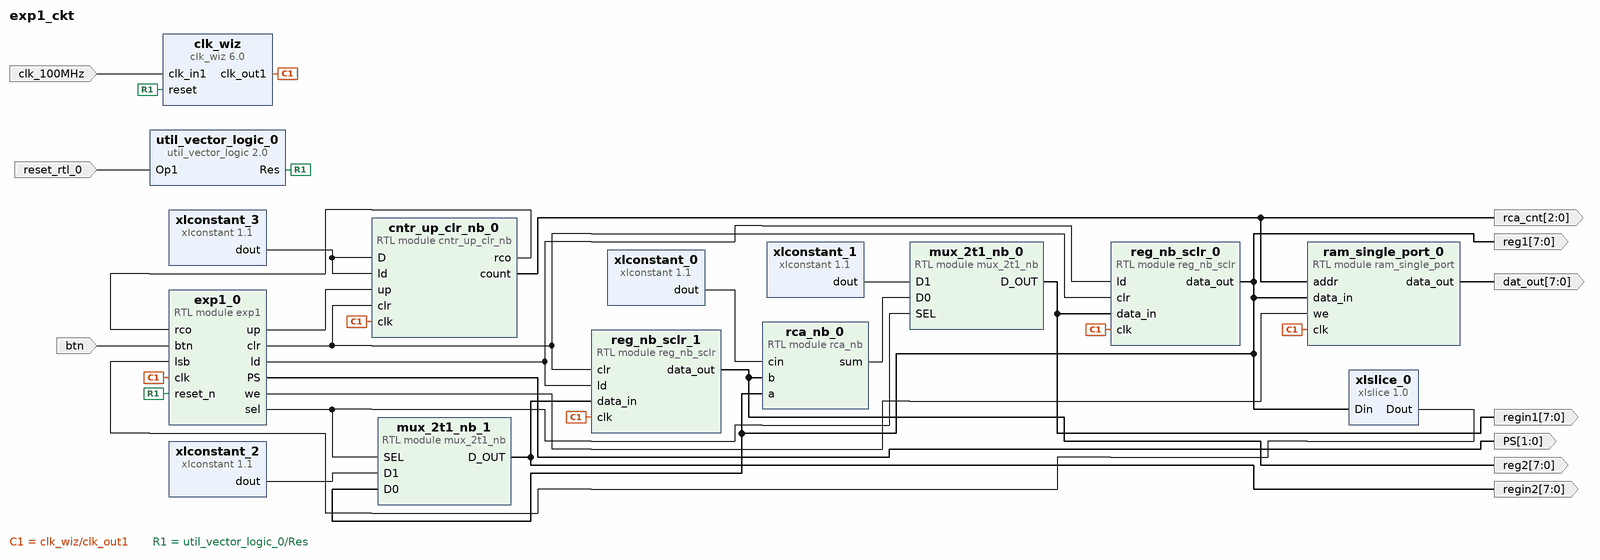
[diagram p0: block diagram of the top level]
# Vivado block design exp1_ckt, xc7a35tcpg236-1, Vivado 2021.2
create_bd_design exp1_ckt

create_bd_port -dir I -type clk clk_100MHz
set_property -dict {CONFIG.FREQ_HZ 100000000} [get_bd_ports clk_100MHz]
create_bd_port -dir I -type rst reset_rtl_0
set_property -dict {CONFIG.POLARITY ACTIVE_LOW} [get_bd_ports reset_rtl_0]
create_bd_port -dir I btn
create_bd_port -dir O -from 7 -to 0 dat_out
create_bd_port -dir O -from 7 -to 0 reg1
create_bd_port -dir O -from 7 -to 0 reg2
create_bd_port -dir O -from 7 -to 0 regin1
create_bd_port -dir O -from 7 -to 0 regin2
create_bd_port -dir O -from 2 -to 0 rca_cnt
create_bd_port -dir O -from 1 -to 0 PS

create_bd_cell -type module -reference ram_single_port ram_single_port_0
set_property -dict {CONFIG.m 8 CONFIG.n 3} [get_bd_cells ram_single_port_0]
create_bd_cell -type module -reference reg_nb_sclr reg_nb_sclr_0
create_bd_cell -type module -reference reg_nb_sclr reg_nb_sclr_1
create_bd_cell -type ip -vlnv xilinx.com:ip:xlconstant:1.1 xlconstant_0
set_property -dict {CONFIG.CONST_VAL 0} [get_bd_cells xlconstant_0]
create_bd_cell -type ip -vlnv xilinx.com:ip:xlslice:1.0 xlslice_0
set_property -dict {CONFIG.DIN_WIDTH 8} [get_bd_cells xlslice_0]
create_bd_cell -type module -reference mux_2t1_nb mux_2t1_nb_0
create_bd_cell -type ip -vlnv xilinx.com:ip:clk_wiz:6.0 clk_wiz
create_bd_cell -type module -reference mux_2t1_nb mux_2t1_nb_1
create_bd_cell -type ip -vlnv xilinx.com:ip:xlconstant:1.1 xlconstant_1
set_property -dict {CONFIG.CONST_VAL 1 CONFIG.CONST_WIDTH 8} [get_bd_cells xlconstant_1]
create_bd_cell -type ip -vlnv xilinx.com:ip:xlconstant:1.1 xlconstant_2
set_property -dict {CONFIG.CONST_VAL 0 CONFIG.CONST_WIDTH 8} [get_bd_cells xlconstant_2]
create_bd_cell -type ip -vlnv xilinx.com:ip:util_vector_logic:2.0 util_vector_logic_0
set_property -dict {CONFIG.C_OPERATION not} [get_bd_cells util_vector_logic_0]
create_bd_cell -type module -reference rca_nb rca_nb_0
create_bd_cell -type ip -vlnv xilinx.com:ip:xlconstant:1.1 xlconstant_3
set_property -dict {CONFIG.CONST_VAL 0 CONFIG.CONST_WIDTH 3} [get_bd_cells xlconstant_3]
create_bd_cell -type module -reference cntr_up_clr_nb cntr_up_clr_nb_0
set_property -dict {CONFIG.n 3} [get_bd_cells cntr_up_clr_nb_0]
create_bd_cell -type module -reference exp1 exp1_0

# ---- connections ----

connect_bd_net [get_bd_pins clk_wiz/clk_out1] \
  [get_bd_pins ram_single_port_0/clk] [get_bd_pins reg_nb_sclr_0/clk] [get_bd_pins reg_nb_sclr_1/clk] \
  [get_bd_pins cntr_up_clr_nb_0/clk] [get_bd_pins exp1_0/clk]
connect_bd_net [get_bd_pins exp1_0/ld] [get_bd_pins reg_nb_sclr_1/ld] [get_bd_pins reg_nb_sclr_0/ld]
connect_bd_net [get_bd_pins exp1_0/clr] [get_bd_pins reg_nb_sclr_1/clr] [get_bd_pins reg_nb_sclr_0/clr] [get_bd_pins cntr_up_clr_nb_0/clr]
connect_bd_net [get_bd_ports btn] [get_bd_pins exp1_0/btn]
connect_bd_net [get_bd_ports clk_100MHz] [get_bd_pins clk_wiz/clk_in1]
connect_bd_net -net cntr_udclr_nb_0_count [get_bd_pins cntr_up_clr_nb_0/count] [get_bd_pins ram_single_port_0/addr] [get_bd_ports rca_cnt]
connect_bd_net [get_bd_pins cntr_up_clr_nb_0/rco] [get_bd_pins exp1_0/rco]
connect_bd_net [get_bd_pins exp1_0/PS] [get_bd_ports PS]
connect_bd_net [get_bd_pins exp1_0/sel] [get_bd_pins mux_2t1_nb_0/SEL] [get_bd_pins mux_2t1_nb_1/SEL]
connect_bd_net [get_bd_pins exp1_0/up] [get_bd_pins cntr_up_clr_nb_0/up]
connect_bd_net [get_bd_pins exp1_0/we] [get_bd_pins ram_single_port_0/we]
connect_bd_net [get_bd_pins mux_2t1_nb_0/D_OUT] [get_bd_pins reg_nb_sclr_0/data_in] [get_bd_ports regin1]
connect_bd_net [get_bd_pins mux_2t1_nb_1/D_OUT] [get_bd_pins reg_nb_sclr_1/data_in] [get_bd_ports regin2]
connect_bd_net [get_bd_pins ram_single_port_0/data_out] [get_bd_ports dat_out]
connect_bd_net [get_bd_pins rca_nb_0/sum] [get_bd_pins mux_2t1_nb_0/D0]
connect_bd_net [get_bd_pins reg_nb_sclr_0/data_out] \
  [get_bd_pins mux_2t1_nb_1/D0] [get_bd_pins ram_single_port_0/data_in] [get_bd_pins xlslice_0/Din] [get_bd_pins rca_nb_0/a] \
  [get_bd_ports reg1]
connect_bd_net [get_bd_pins reg_nb_sclr_1/data_out] [get_bd_pins rca_nb_0/b] [get_bd_ports reg2]
connect_bd_net -net reset_rtl_0_1 [get_bd_pins util_vector_logic_0/Res] [get_bd_pins clk_wiz/reset] [get_bd_pins exp1_0/reset_n]
connect_bd_net -net reset_rtl_0_2 [get_bd_ports reset_rtl_0] [get_bd_pins util_vector_logic_0/Op1]
connect_bd_net [get_bd_pins xlconstant_0/dout] [get_bd_pins rca_nb_0/cin]
connect_bd_net [get_bd_pins xlconstant_1/dout] [get_bd_pins mux_2t1_nb_0/D1]
connect_bd_net [get_bd_pins xlconstant_2/dout] [get_bd_pins mux_2t1_nb_1/D1]
connect_bd_net [get_bd_pins xlconstant_3/dout] [get_bd_pins cntr_up_clr_nb_0/D] [get_bd_pins cntr_up_clr_nb_0/ld]
connect_bd_net [get_bd_pins xlslice_0/Dout] [get_bd_pins exp1_0/lsb]

validate_bd_design
save_bd_design
